# EAGLE schematic picopter_tx (EAGLE 6.5.0)
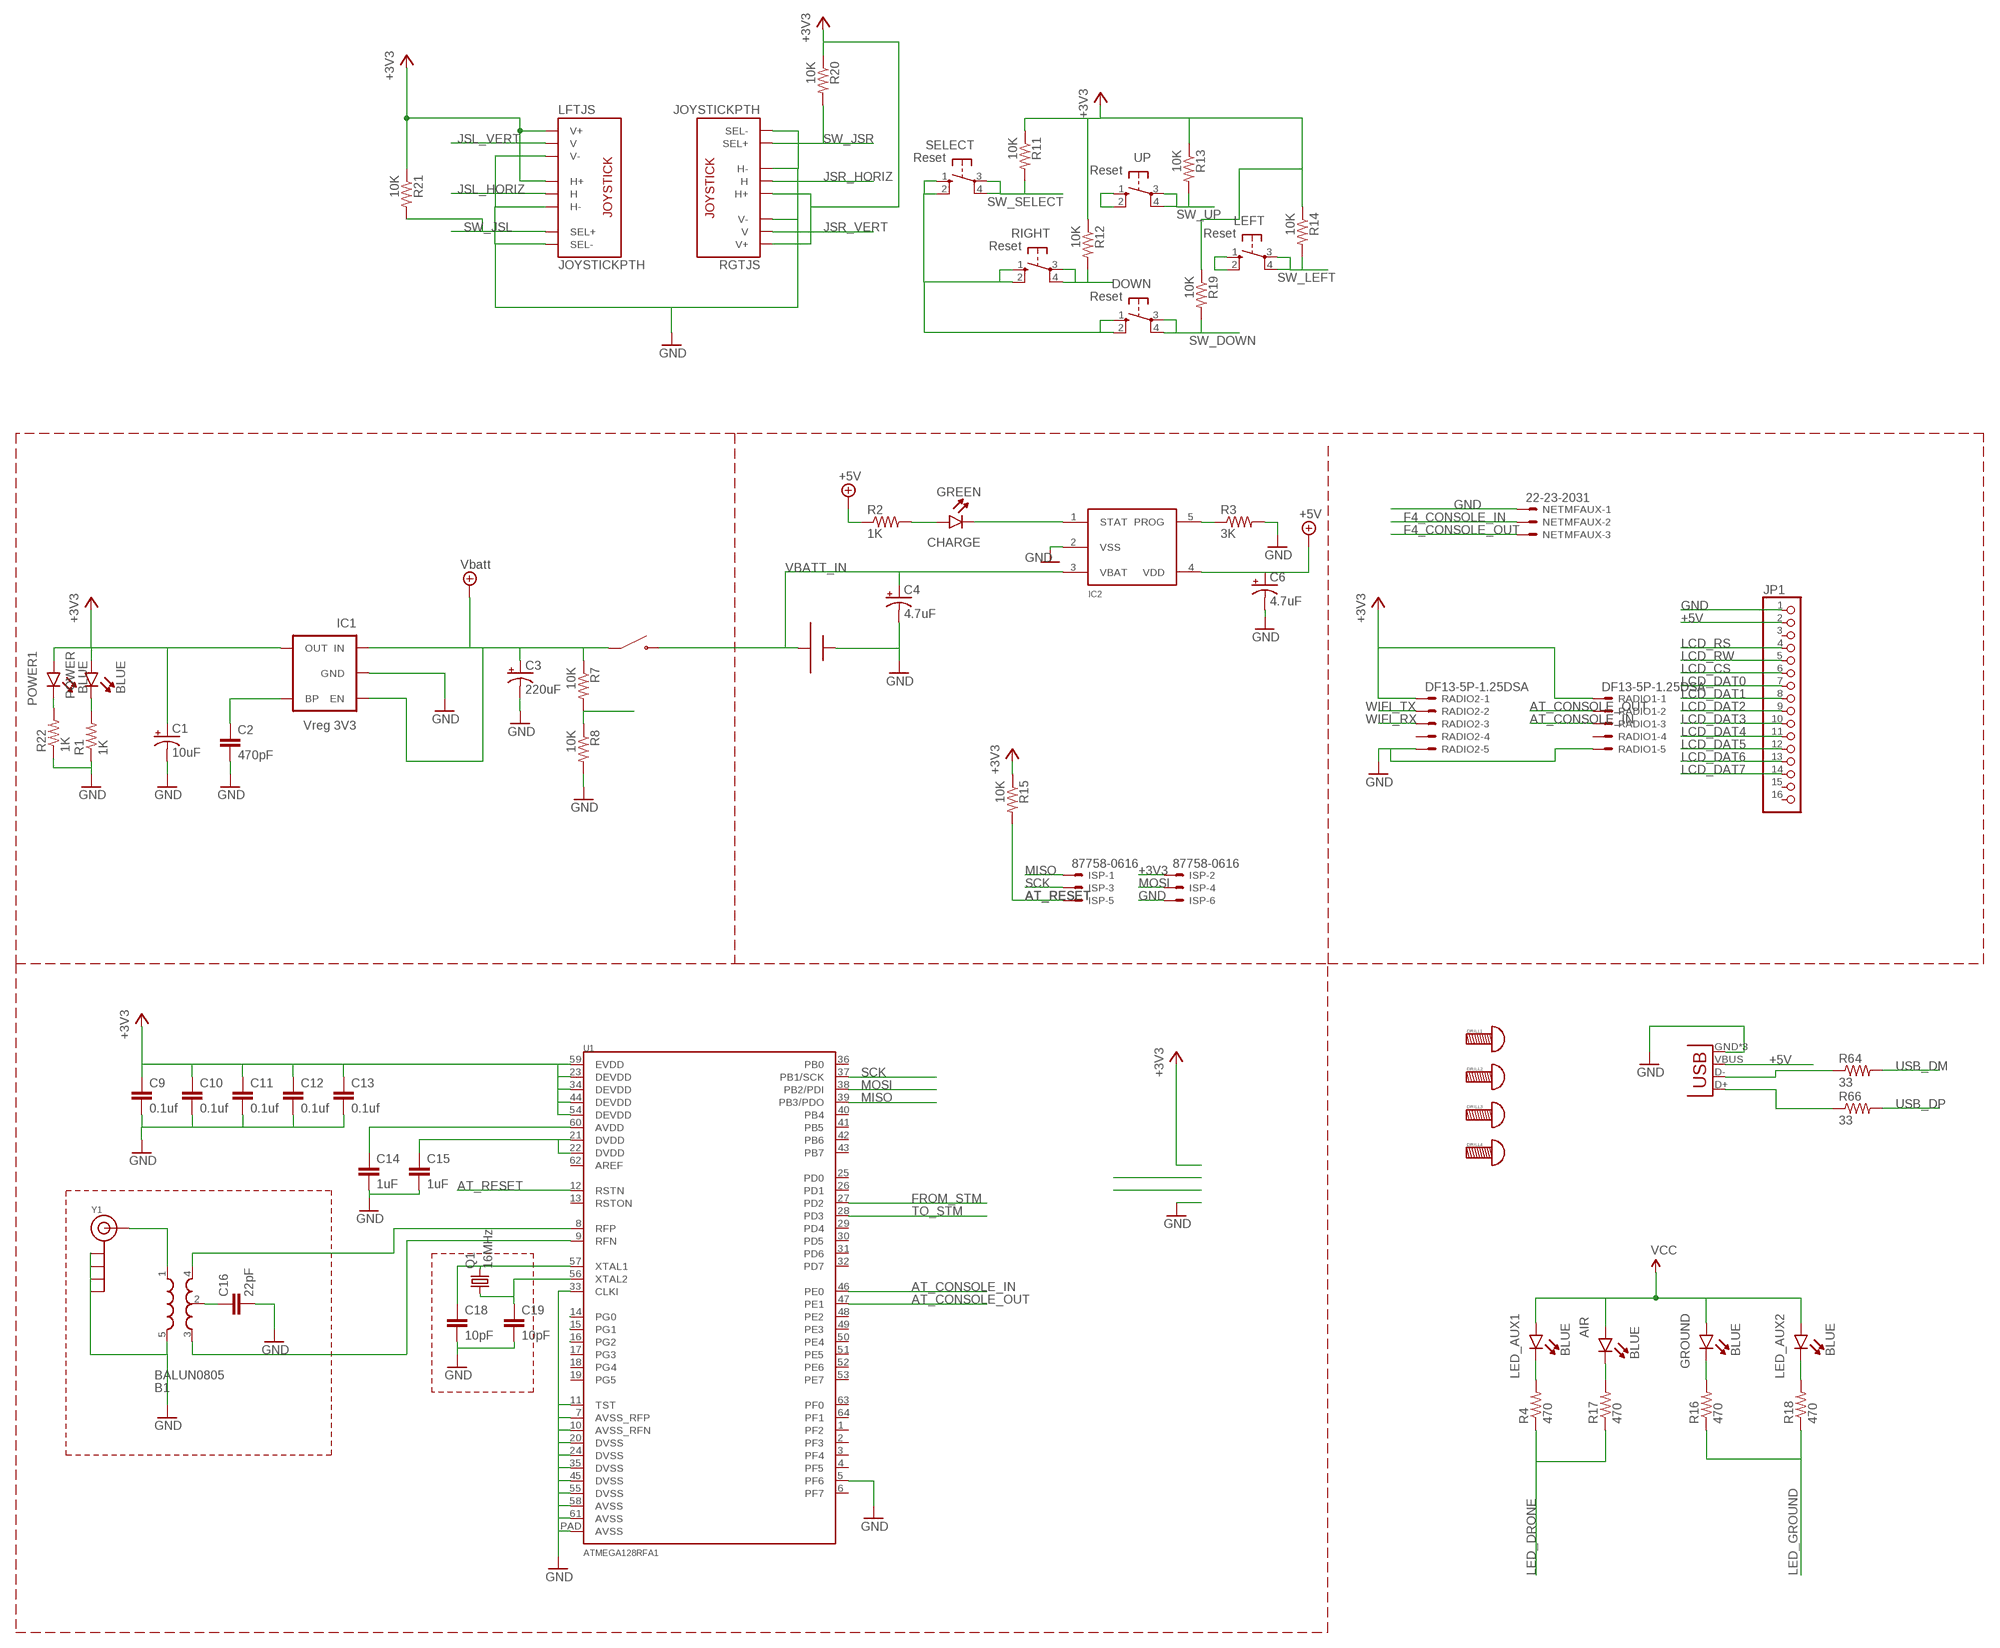
[diagram p0: schematic, sheet 1, part 1 of 2]
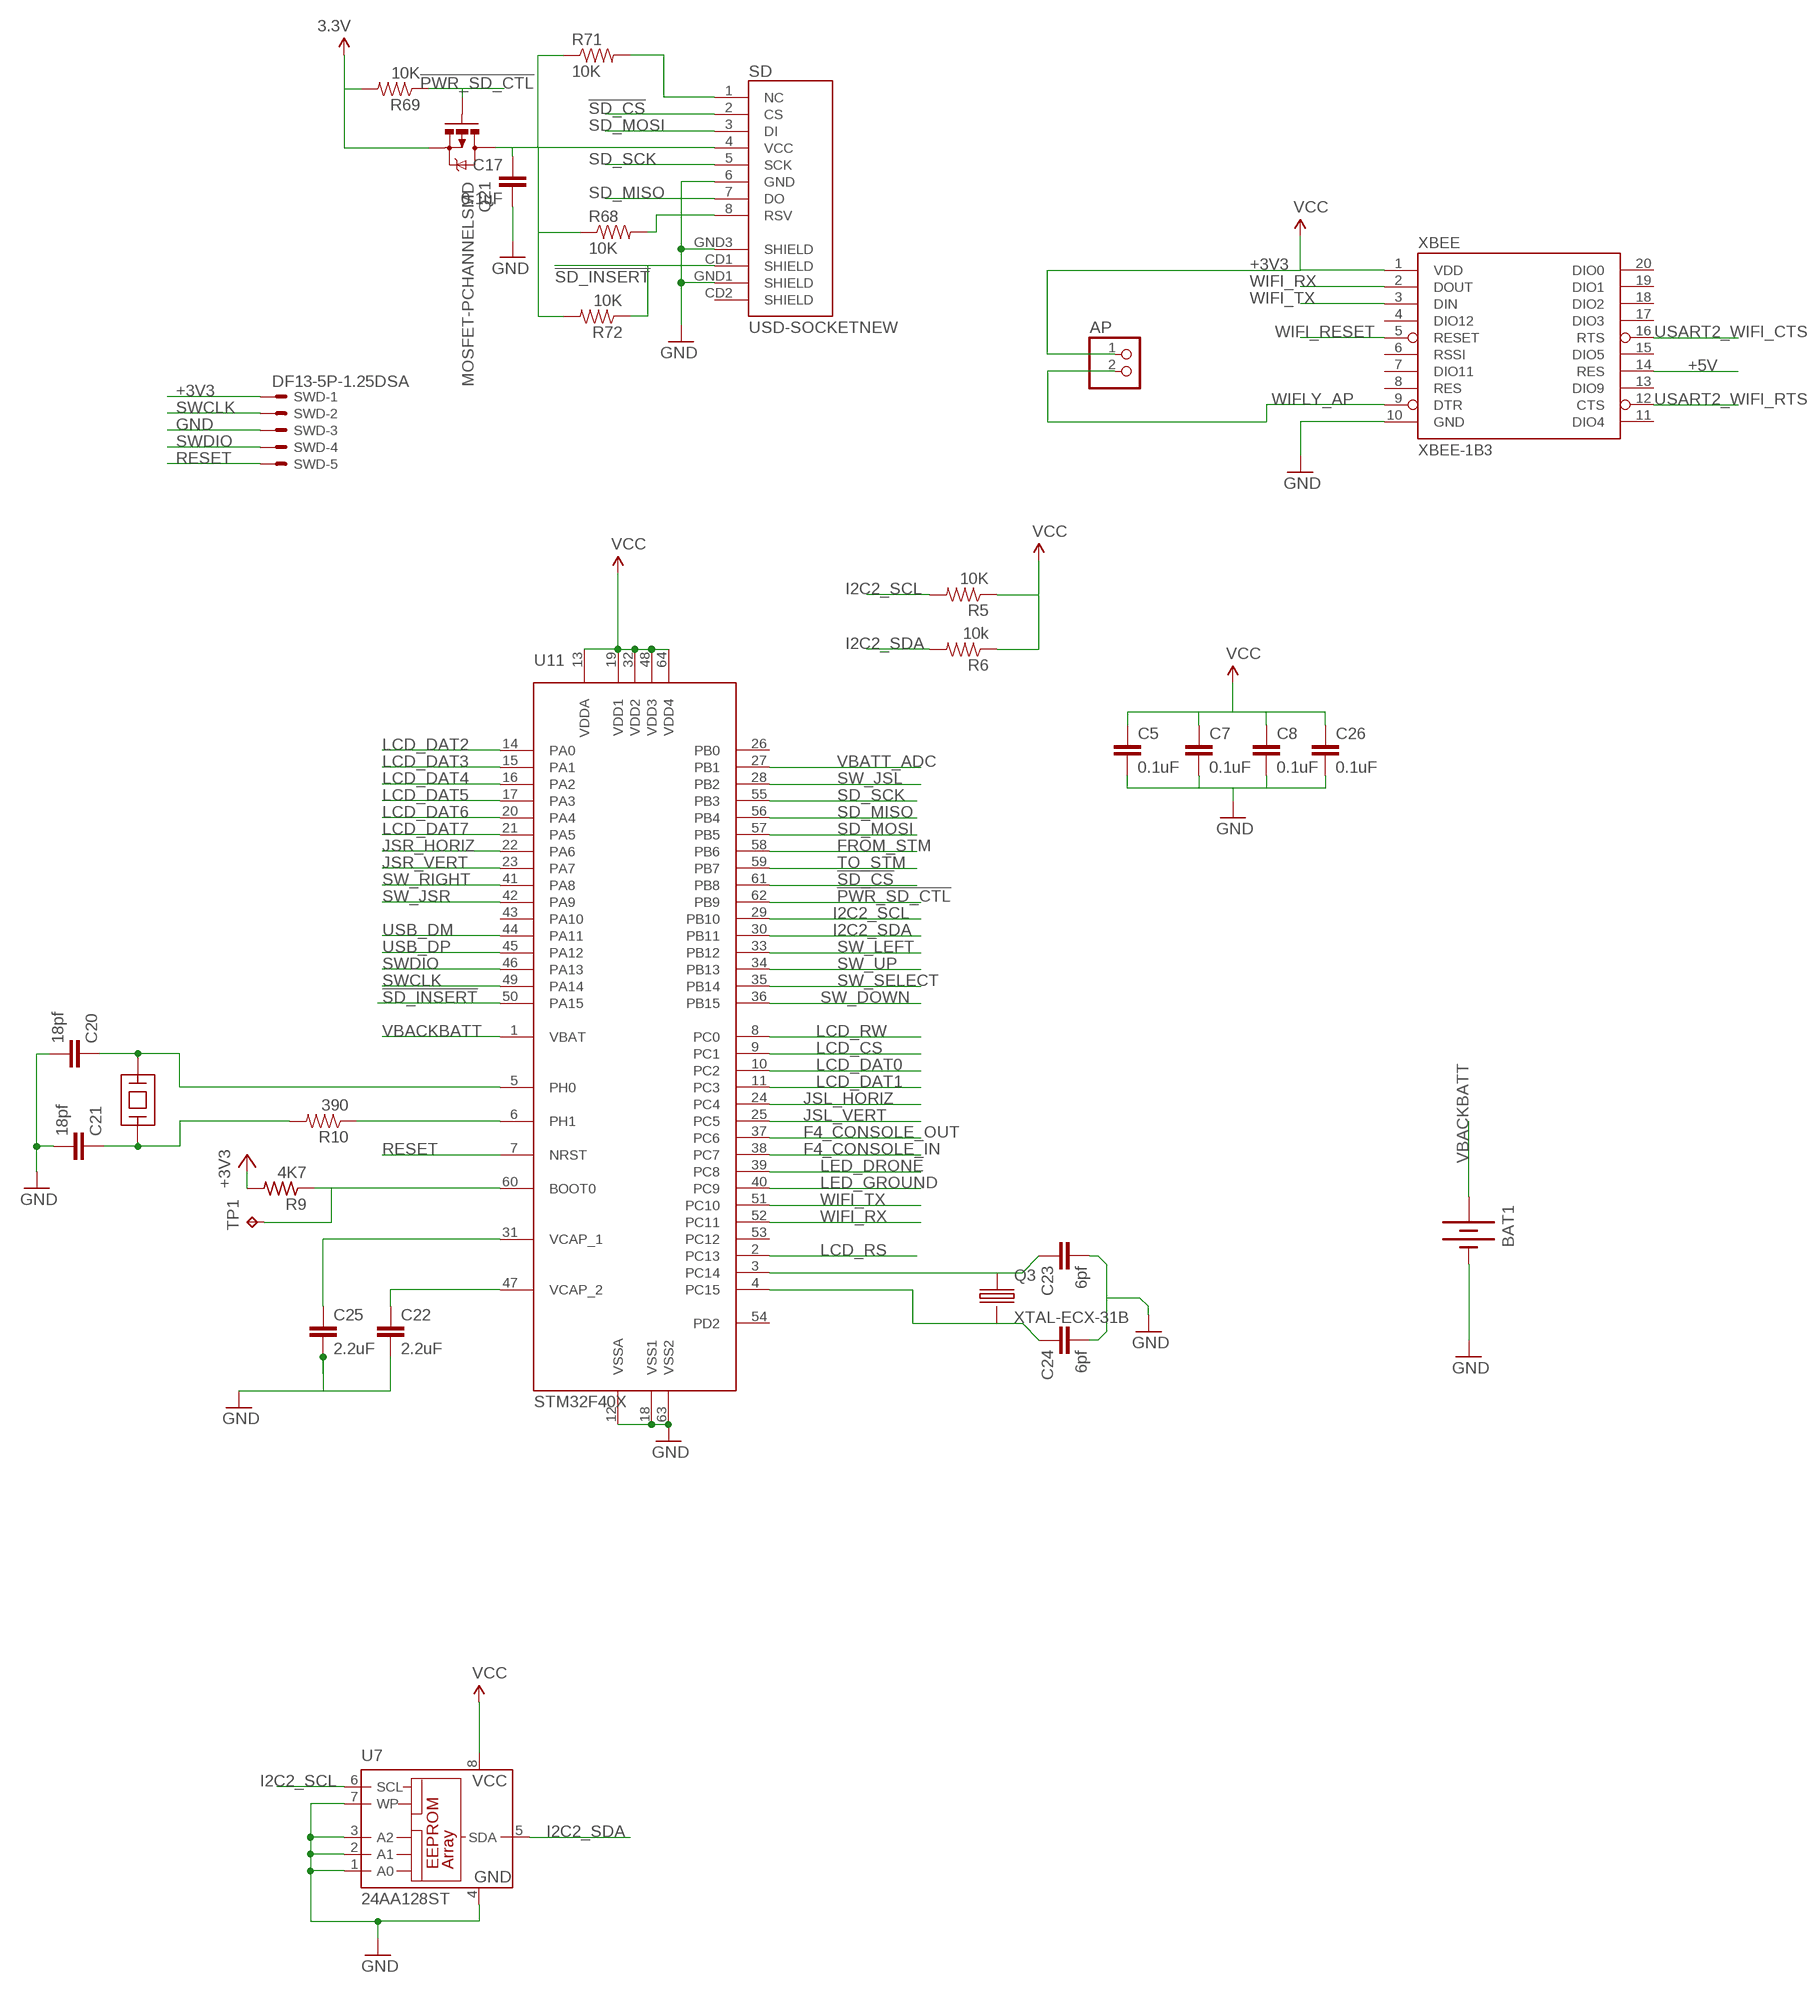
[diagram p1: schematic, sheet 1, part 2 of 2]

## Parts
AIR  BLUE  SMD_LED0805  [LED0805]
AP  PINHD-1X2  [1X02]
B1  BALUN0805  [BALUN]
BAT1  BATTERY12MM  [BATTCON_12MM]
BATT2  BATT-CONNJST-PH-90  [JST-PH-2-90]
C1  10uF  CPOL-USSMCB  [SMC_B]
C2  470pF  C-EUC0603  [C0603]
C3  220uF  CPOL-USSMCB  [SMC_B]
C4  4.7uF  CPOL-USSMCB  [SMC_B]
C5  0.1uF  C-EUC0603  [C0603]
C6  4.7uF  CPOL-USSMCB  [SMC_B]
C7  0.1uF  C-EUC0603  [C0603]
C8  0.1uF  C-EUC0603  [C0603]
C9  0.1uf  C-EUC0603  [C0603]
C10  0.1uf  C-EUC0603  [C0603]
C11  0.1uf  C-EUC0603  [C0603]
C12  0.1uf  C-EUC0603  [C0603]
C13  0.1uf  C-EUC0603  [C0603]
C14  1uF  C-EUC0603  [C0603]
C15  1uF  C-EUC0603  [C0603]
C16  22pF  C-EUC0603  [C0603]
C17  0.1uF  CAP0805  [0805]
C18  10pF  C-EUC0603  [C0603]
C19  10pF  C-EUC0603  [C0603]
C20  18pf  CAP0805  [0805]
C21  18pf  CAP0805  [0805]
C22  2.2uF  CAP0805  [0805]
C23  6pf  CAP0805  [0805]
C24  6pf  CAP0805  [0805]
C25  2.2uF  CAP0805  [0805]
C26  0.1uF  C-EUC0603  [C0603]
CHARGE  GREEN  SMD_LED0805  [LED0805]
DOWN  Reset  10-XX  [B3F-10XX]
DRILL1  HOLE-4-40  [HOLE-4-40]
DRILL2  HOLE-4-40  [HOLE-4-40]
DRILL3  HOLE-4-40  [HOLE-4-40]
DRILL4  HOLE-4-40  [HOLE-4-40]
GROUND  BLUE  SMD_LED0805  [LED0805]
IC1  Vreg 3V3  V_REG_LDOSMD  [SOT23-5]
IC2  MCP-LI-CHARGER-1  [SOT23-5]
ISP  87758-0616  [87758-0616]
JP1  PINHD-1X16  [1X16]
LED_AUX1  BLUE  SMD_LED0805  [LED0805]
LED_AUX2  BLUE  SMD_LED0805  [LED0805]
LEFT  Reset  10-XX  [B3F-10XX]
LFTJS  JOYSTICKPTH  [JOYSTICK]
NETMFAUX  22-23-2031  [22-23-2031]
POWER  BLUE  SMD_LED0805  [LED0805]
POWER1  BLUE  SMD_LED0805  [LED0805]
Q1  16MHz  CRYSTALCTS406  [CTS406]
Q2  ABRACON_ABM7  [ABRACON_ABM7_CERAMIC_XTAL]
Q3  XTAL-ECX-31B  [CRYSTAL-EXC-31B]
Q21  MOSFET-PCHANNELSMD  [SOT23-3]
R1  1K  R-US_R0603  [R0603]
R2  1K  R-US_R0603  [R0603]
R3  3K  R-US_R0603  [R0603]
R4  470  RESISTOR0805-RES  [0805]
R5  10K  RESISTOR0805-RES  [0805]
R6  10k  RESISTOR0805-RES  [0805]
R7  10K  R-US_R0603  [R0603]
R8  10K  R-US_R0603  [R0603]
R9  4K7  R-US_R0603  [R0603]
R10  390  RESISTOR0805-RES  [0805]
R11  10K  R-US_R0603  [R0603]
R12  10K  R-US_R0603  [R0603]
R13  10K  R-US_R0603  [R0603]
R14  10K  R-US_R0603  [R0603]
R15  10K  R-US_R0603  [R0603]
R16  470  RESISTOR0805-RES  [0805]
R17  470  RESISTOR0805-RES  [0805]
R18  470  RESISTOR0805-RES  [0805]
R19  10K  R-US_R0603  [R0603]
R20  10K  R-US_R0603  [R0603]
R21  10K  R-US_R0603  [R0603]
R22  1K  R-US_R0603  [R0603]
R64  33  RESISTOR0805-RES  [0805]
R66  33  RESISTOR0805-RES  [0805]
R68  10K  RESISTOR0805-RES  [0805]
R69  10K  RESISTOR0805-RES  [0805]
R71  10K  RESISTOR0805-RES  [0805]
R72  10K  RESISTOR0805-RES  [0805]
RADIO1  DF13-5P-1.25DSA  [DF13-5P-1.25DSA]
RADIO2  DF13-5P-1.25DSA  [DF13-5P-1.25DSA]
RGTJS  JOYSTICKPTH  [JOYSTICK]
RIGHT  Reset  10-XX  [B3F-10XX]
S1  SWITCH-PWR-CNKOS2  [SWITCH-SPDT-CNK-OS2]
SD  USD-SOCKETNEW  [MICRO-SD-SOCKET-PP]
SELECT  Reset  10-XX  [B3F-10XX]
SWD  DF13-5P-1.25DSA  [DF13-5P-1.25DSA]
TP1  TPTP15R  [TP15R]
U1  ATMEGA128RFA1  [QFN-64]
U7  24AA128ST  [TSSOP8]
U11  STM32F40X  [LQFP64]
UP  Reset  10-XX  [B3F-10XX]
USB1  USB-MICROB  [USB-MICROB]
XBEE  XBEE-1B3  [XBEE-SMD]
Y1  SMA_EDGE  [SMA-EDGE]

## Nets
!PWR_SD_CTL: Q21.1(G) R69.1 U11.62(PB9)
!SD_CS: SD.2(CS) U11.61(PB8)
!SD_INSERT: R72.1 SD.CD1(SHIELD) U11.50(PA15)
+3V3 [power]: AIR.P$1(A) AP.1 C1.+ C5.1 C7.1 C8.1 C9.1 C10.1 C11.1 C12.1 C13.1 C26.1 GROUND.P$1(A) IC1.5(OUT) ISP.2 LED_AUX1.P$1(A) LED_AUX2.P$1(A) LFTJS.H1(H+) LFTJS.V1(V+) POWER1.P$1(A) POWER.P$1(A) Q21.2(S) R5.1 R6.1 R9.2 R11.1 R12.1 R13.1 R14.1 R15.1 R19.1 R20.1 R21.1 R69.2 RADIO1.1 RADIO2.1 RGTJS.H1(H+) RGTJS.V1(V+) SWD.1 U1.23(DEVDD) U1.34(DEVDD) U1.44(DEVDD) U1.54(DEVDD) U1.59(EVDD) U7.8(VCC) U11.13(VDDA) U11.19(VDD1) U11.32(VDD2) U11.48(VDD3) U11.64(VDD4) XBEE.1(VDD) ; supply symbol labelled VCC, 3.3V
+5V: C6.+ IC2.4(VDD) JP1.2 R2.1 USB1.VBUS XBEE.14(RES)
AT_CONSOLE_IN: RADIO1.3 U1.46(PE0)
AT_CONSOLE_OUT: RADIO1.2 U1.47(PE1)
AT_RESET: ISP.5 R15.2 U1.12(RSTN)
F4_CONSOLE_IN: NETMFAUX.2 U11.38(PC7)
F4_CONSOLE_OUT: NETMFAUX.3 U11.37(PC6)
FROM_STM: U1.27(PD2) U11.58(PB6)
GND: B1.5(GND) BAT1.GND(-) BATT2.N C1.- C2.2 C3.- C4.- C5.2 C6.- C7.2 C8.2 C9.2 C10.2 C11.2 C12.2 C13.2 C14.2 C15.2 C16.2 C17.2 C18.2 C19.2 C20.2 C21.2 C22.2 C23.2 C24.2 C25.2 C26.2 DOWN.1(S) DOWN.2(S1) IC1.2(GND) IC2.2(VSS) ISP.6 JP1.1 LEFT.1(S) LEFT.2(S1) LFTJS.B2A(SEL-) LFTJS.H3(H-) LFTJS.V3(V-) NETMFAUX.1 R1.1 R3.2 R8.2 R22.1 RADIO1.5 RADIO2.5 RGTJS.B2A(SEL-) RGTJS.H3(H-) RGTJS.V3(V-) RIGHT.1(S) RIGHT.2(S1) SD.6(GND) SD.GND1(SHIELD) SD.GND3(SHIELD) SELECT.1(S) SELECT.2(S1) SWD.3 U1.5(PF6) U1.7(AVSS_RFP) U1.10(AVSS_RFN) U1.11(TST) U1.20(DVSS) U1.24(DVSS) U1.33(CLKI) U1.35(DVSS) U1.45(DVSS) U1.55(DVSS) U1.58(AVSS) U1.61(AVSS) U1.PAD(AVSS) U7.1(A0) U7.2(A1) U7.3(A2) U7.4(GND) U7.7(WP) U11.12(VSSA) U11.18(VSS1) U11.63(VSS2) UP.1(S) UP.2(S1) USB1.GND USB1.MT1(GND) USB1.MT2(GND) XBEE.10(GND) Y1.GND@0(GND) Y1.GND@1(GND) Y1.GND@2(GND) Y1.GND@3(GND)
I2C2_SCL: R5.2 U7.6(SCL) U11.29(PB10)
I2C2_SDA: R6.2 U7.5(SDA) U11.30(PB11)
JSL_HORIZ: LFTJS.H2(H) U11.24(PC4)
JSL_VERT: LFTJS.V2(V) U11.25(PC5)
JSR_HORIZ: RGTJS.H2(H) U11.22(PA6)
JSR_VERT: RGTJS.V2(V) U11.23(PA7)
LCD_CS: JP1.6 U11.9(PC1)
LCD_DAT0: JP1.7 U11.10(PC2)
LCD_DAT1: JP1.8 U11.11(PC3)
LCD_DAT2: JP1.9 U11.14(PA0)
LCD_DAT3: JP1.10 U11.15(PA1)
LCD_DAT4: JP1.11 U11.16(PA2)
LCD_DAT5: JP1.12 U11.17(PA3)
LCD_DAT6: JP1.13 U11.20(PA4)
LCD_DAT7: JP1.14 U11.21(PA5)
LCD_RS: JP1.4 U11.2(PC13)
LCD_RW: JP1.5 U11.8(PC0)
LED_DRONE: R4.1 R17.1 U11.39(PC8)
LED_GROUND: R16.1 R18.1 U11.40(PC9)
MISO: ISP.1 U1.39(PB3/PDO)
MOSI: ISP.4 U1.38(PB2/PDI)
N$1: CHARGE.C IC2.1(STAT)
N$2: CHARGE.P$1(A) R2.2
N$4: AIR.C R17.2
N$5: LED_AUX1.C R4.2
N$6: U1.14(PG0)
N$7: U1.15(PG1)
N$8: U1.16(PG2)
N$9: POWER.C R1.2
N$10: B1.2(GND) C16.1
N$11: IC2.5(PROG) R3.1
N$12: GROUND.C R16.2
N$14: R9.1 TP1.TP U11.60(BOOT0)
N$15: POWER1.C R22.2
N$16: R10.1 U11.6(PH1)
N$17: LED_AUX2.C R18.2
N$19: C22.1 U11.47(VCAP_2)
N$20: C25.1 U11.31(VCAP_1)
N$25: C2.1 IC1.4(BP)
N$26: C15.1 U1.21(DVDD) U1.22(DVDD)
N$27: C14.1 U1.60(AVDD)
N$28: B1.1(IN) Y1.SIG(SIGNAL)
N$29: B1.3(OUT1) U1.9(RFN)
N$30: B1.4(OUT2) U1.8(RFP)
N$33: C18.1 Q1.3 U1.57(XTAL1)
N$34: C19.1 Q1.1 U1.56(XTAL2)
N$68: R68.2 SD.8(RSV)
N$69: R71.2 SD.1(NC)
N$92: R64.1 USB1.D-
N$93: R66.1 USB1.D+
OSC32_MHZ_IN: C23.1 Q3.P$1 U11.3(PC14)
OSC32_MHZ_OUT: C24.1 Q3.P$2 U11.4(PC15)
PWR_SD_CARD: C17.1 Q21.3(D) R68.1 R71.1 R72.2 SD.4(VCC)
RESET: SWD.5 U11.7(NRST)
SCK: ISP.3 U1.37(PB1/SCK)
SD_MISO: SD.7(DO) U11.56(PB4)
SD_MOSI: SD.3(DI) U11.57(PB5)
SD_SCK: SD.5(SCK) U11.55(PB3)
SW_DOWN: DOWN.3(P) DOWN.4(P1) R19.2 U11.36(PB15)
SW_JSL: LFTJS.B1A(SEL+) R21.2 U11.28(PB2)
SW_JSR: R20.2 RGTJS.B1A(SEL+) U11.42(PA9)
SW_LEFT: LEFT.3(P) LEFT.4(P1) R14.2 U11.33(PB12)
SW_RIGHT: R12.2 RIGHT.3(P) RIGHT.4(P1) U11.41(PA8)
SW_SELECT: R11.2 SELECT.3(P) SELECT.4(P1) U11.35(PB14)
SW_UP: R13.2 U11.34(PB13) UP.3(P) UP.4(P1)
SWCLK: SWD.2 U11.49(PA14)
SWDIO: SWD.4 U11.46(PA13)
TO_STM: U1.28(PD3) U11.59(PB7)
USART2_WIFI_CTS: XBEE.16(RTS)
USART2_WIFI_RTS: XBEE.12(CTS)
USB_DM: R64.2 U11.44(PA11)
USB_DP: R66.2 U11.45(PA12)
VBACKBATT: BAT1.PWR@1(+) U11.1(VBAT)
VBATT: C3.+ IC1.1(IN) IC1.3(EN) R7.1 S1.1 ; supply symbol labelled Vbatt
VBATT_ADC: R7.2 R8.1 U11.27(PB1)
VBATT_IN: BATT2.P C4.+ IC2.3(VBAT) S1.2
WIFI_RESET: XBEE.5(RESET)
WIFI_RX: RADIO2.3 U11.52(PC11) XBEE.2(DOUT)
WIFI_TX: RADIO2.2 U11.51(PC10) XBEE.3(DIN)
WIFLY_AP: AP.2 XBEE.9(DTR)
XTAL3: C20.1 Q2.P$1 U11.5(PH0)
XTAL4: C21.1 Q2.P$2 R10.2
Unconnected: JP1.3 JP1.15 JP1.16 RADIO1.4 RADIO2.4 SD.CD2(SHIELD) U1.1(PF2) U1.2(PF3) U1.3(PF4) U1.4(PF5) U1.6(PF7) U1.13(RSTON) U1.17(PG3) U1.18(PG4) U1.19(PG5) U1.25(PD0) U1.26(PD1) U1.29(PD4) U1.30(PD5) U1.31(PD6) U1.32(PD7) U1.36(PB0) U1.40(PB4) U1.41(PB5) U1.42(PB6) U1.43(PB7) U1.48(PE2) U1.49(PE3) U1.50(PE4) U1.51(PE5) U1.52(PE6) U1.53(PE7) U1.62(AREF) U1.63(PF0) U1.64(PF1) U11.26(PB0) U11.43(PA10) U11.53(PC12) U11.54(PD2) XBEE.4(DIO12) XBEE.6(RSSI) XBEE.7(DIO11) XBEE.8(RES) XBEE.11(DIO4) XBEE.13(DIO9) XBEE.15(DIO5) XBEE.17(DIO3) XBEE.18(DIO2) XBEE.19(DIO1) XBEE.20(DIO0)

## Library data of the parts
AIR CHARGE GROUND LED_AUX1 LED_AUX2 POWER POWER1 = SoftwareLogisticsParts:SMD_LED0805
AP = pinhead:PINHD-1X2: PIN HEADER
B1 = palmquad_alpha:BALUN
BAT1 = SparkFun-Electromechanical:BATTERY: Battery Holders Various common sizes : AA, AAA, 20mm coin cell and 12mm coin cell.
BATT2 = palmquad_alpha:BATT-CONN
C1 C3 C4 C6 = rcl:CPOL-US: POLARIZED CAPACITOR, American symbol
C2 C5 C7-C16 C18 C19 C26 = rcl:C-EU: CAPACITOR, European symbol
C17 = SparkFun-Capacitors:CAP: Capacitor Standard 0603 ceramic capacitor, and 0.1" leaded capacitor.
C20-C25 = SparkFun-Passives:CAP: Capacitor Standard 0603 ceramic capacitor, and 0.1" leaded capacitor.
DOWN LEFT RIGHT SELECT UP = switch-omron:10-XX: OMRON SWITCH
DRILL1-DRILL4 = palmquad_alpha:HOLE
IC1 = palmquad_alpha:V_REG_LDO: Voltage Regulator LDO Standard 150mA LDO voltage regulator in SOT-23 layout. Micrel part MIC5205. BP (by-pass) pin is used to lower output noise with 470pF cap.
IC2 = palmquad_alpha:MCP-LI-CHARGER-1
ISP = con-molex:87758-0616: 6 Pin - 2mm Dual Row Single Wafer, Vertical T/H HDR Source: http://www.molex.com/pdm_docs/sd/877580616_sd.pdf; MPN: 87758-0616; OC_FARNELL: 7472323; OC_NEWARK: 25M5667
JP1 = pinhead:PINHD-1X16: PIN HEADER
LFTJS RGTJS = SparkFun:JOYSTICK: Thumb Joystick Joystick commonly found in PS2 controllers. Two pots and a select switch. Footprint proven. Spark Fun Electronics SKU : COM-09032
NETMFAUX = con-molex:22-23-2031: .100" (2.54mm) Center Header - 3 Pin; MF: MOLEX; MPN: 22-23-2031; OC_FARNELL: 1462950; OC_NEWARK: 30C0862
Q1 = palmquad_alpha:CRYSTAL: CRYSTAL; OC_FARNELL: unknown; OC_NEWARK: unknown
Q2 = Nwazet.Go:ABRACON_ABM7
Q3 = SoftwareLogisticsParts:XTAL-ECX-31B
Q21 = SparkFun-DiscreteSemi:MOSFET-PCHANNEL: Generic PMOSFET
R1-R3 R7-R9 R11-R15 R19-R22 = rcl:R-US_: RESISTOR, American symbol
R4-R6 R10 R16-R18 = SparkFun-Passives:RESISTOR: Resistor Basic schematic elements and footprints for 0603, 1206, and PTH resistors.
R64 R66 R68 R69 R71 R72 = SparkFun-Resistors:RESISTOR: Resistor Basic schematic elements and footprints for 0603, 1206, and PTH resistors.
RADIO1 RADIO2 SWD = pixhawk2:DF13-5P-1.25?
S1 = palmquad_alpha:SWITCH-PWR
SD = SparkFun-Connectors:USD-SOCKET: microSD Socket Push-push type uSD socket. Schematic element and footprint production proven. Spark Fun Electronics SKU : PRT-00127. tDoc lines correctly indicate media card edge positions when inserting (unlocked, locked, depressed).
TP1 = testpad:TP: Test pad
U1 = palmquad_alpha:ATMEGA128RFA1
U7 = microchip:24*: Serial EEPROM I2C; MF: MICROCHIP; MPN: 24AA128-I/ST; OC_FARNELL: unknown; OC_NEWARK: 92C6843
U11 = GHI:STM32F40X
USB1 = SparkFun-Connectors:USB: USB Connectors USB-B-PTH is fully proven SKU : PRT-00139/CONN-08278 USB-miniB is fully proven SKU : PRT-00587 USB-A-PCB is untested. USB-A-H is throughly reviewed, but untested. Spark Fun Electronics SKU : PRT-00437 USB-B-SMT is throughly reviewed, but untested. Needs silkscreen touching up. USB-A-S has not been used/tested USB-MB-H has not been used/tested USB-MICROB has been used. CONN-09505; PROD_ID: CONN-09505
XBEE = SparkFun-RF:XBEE-1: Xbee module footprints
Y1 = palmquad_alpha:SMA_EDGE: SMA Antenna Connector End launch SMA connector. The paste layer has been removed so that the connector can be hand soldered onto the board after reflow.